# Altium project 4_bit_alu.PrjPcb
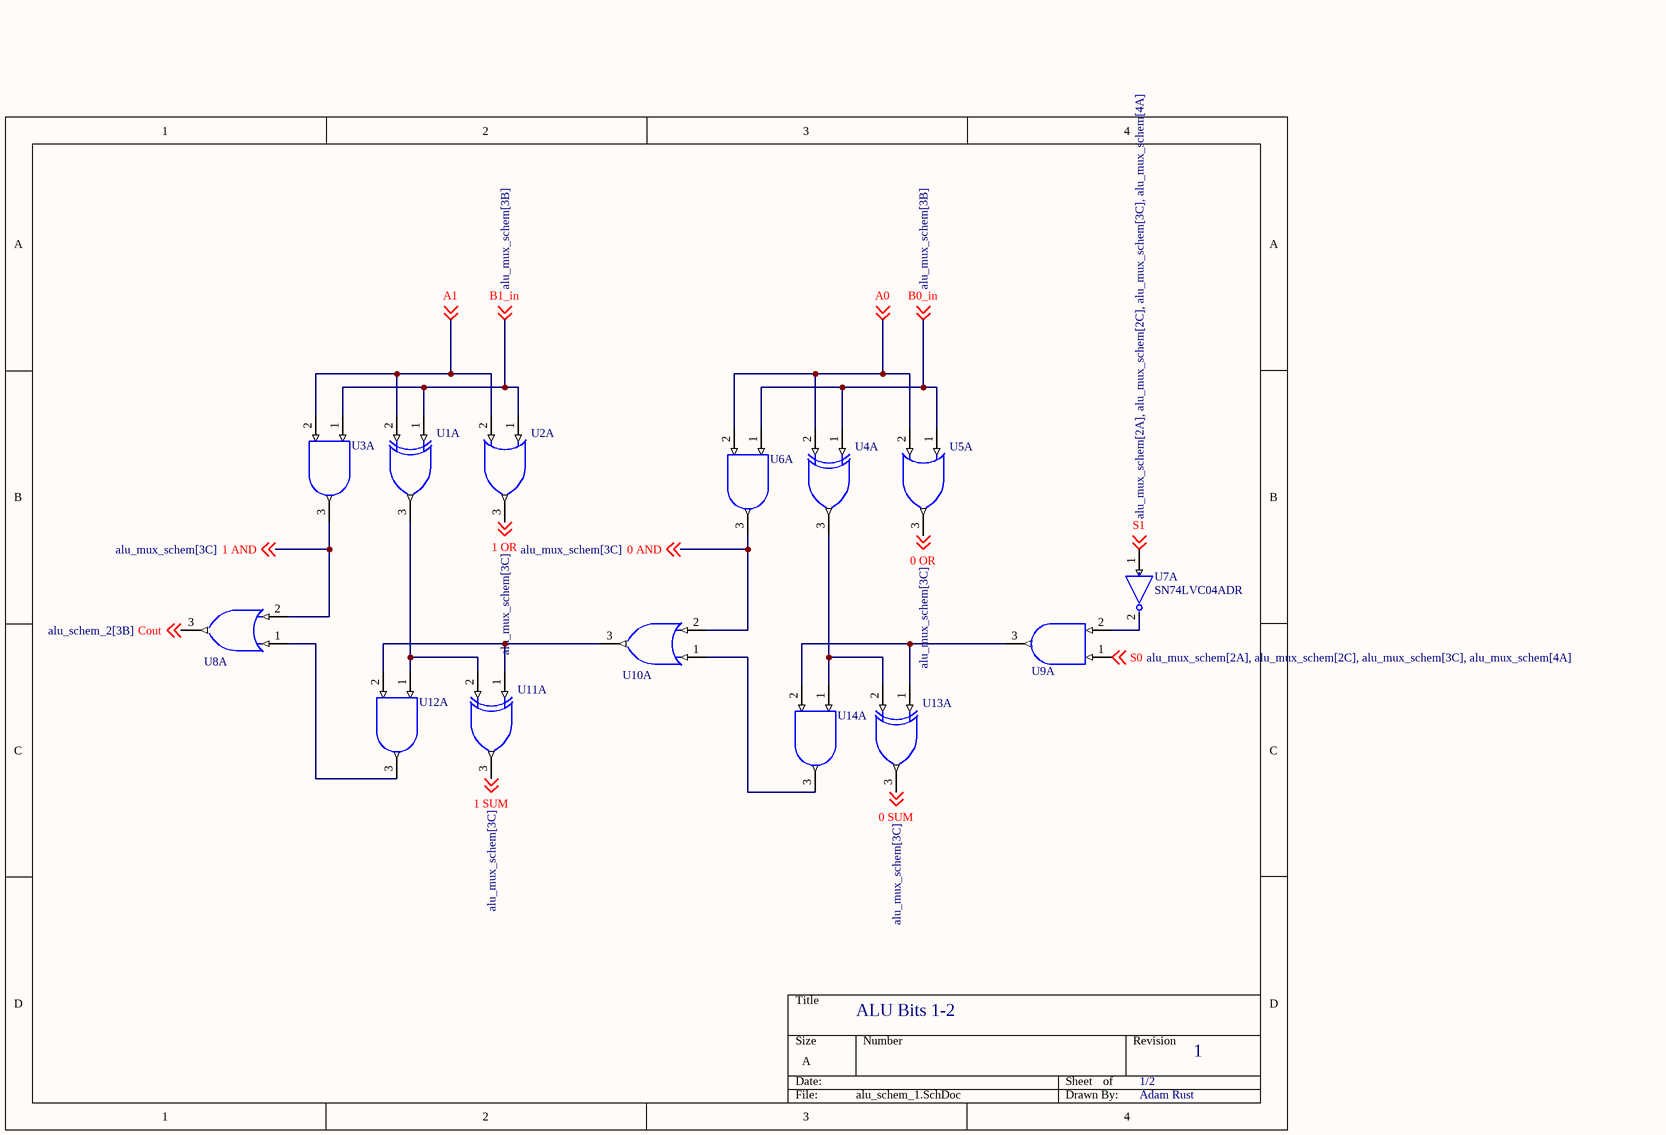
[diagram p0: alu_schem_1.SchDoc]
4 sheets, 39 parts. Net scope: global (net labels, ports and power ports of the same name join across sheets).
Sheets:
  alu_schem_1.SchDoc
  alu_schem_2.SchDoc
  alu_mux_schem.SchDoc
  alu_raspberrypi_micro.SchDoc

## Sheet alu_schem_1.SchDoc
size A; SheetNumber: 1; SheetTotal: 4

### Parts
U1  SN74LVC86ARGYR  [RGY0014A_V]  (value not drawn)  (part A of 5)
U2  SN74LVC32APWRG4  [PW0014A_N]  (value not drawn)  (part A of 5)
U3  SN74LVC08ADR  [D0014A_N]  (value not drawn)  (part A of 5)
U4  SN74LVC86ARGYR  [RGY0014A_V]  (value not drawn)  (part A of 5)
U5  SN74LVC32APWRG4  [PW0014A_N]  (value not drawn)  (part A of 5)
U6  SN74LVC08ADR  [D0014A_N]  (value not drawn)  (part A of 5)
U7  SN74LVC04ADR  [FP-D0014A-IPC_A]  (part A of 7)
U8  SN74LVC32APWRG4  [PW0014A_N]  (value not drawn)  (part A of 5)
U9  SN74LVC08ADR  [D0014A_N]  (value not drawn)  (part A of 5)
U10  SN74LVC32APWRG4  [PW0014A_N]  (value not drawn)  (part A of 5)
U11  SN74LVC86ARGYR  [RGY0014A_V]  (value not drawn)  (part A of 5)
U12  SN74LVC08ADR  [D0014A_N]  (value not drawn)  (part A of 5)
U13  SN74LVC86ARGYR  [RGY0014A_V]  (value not drawn)  (part A of 5)
U14  SN74LVC08ADR  [D0014A_N]  (value not drawn)  (part A of 5)

### Nets
0 AND: U6.3(1Y) U10.2(1B) ; off-sheet 0 AND
0 OR: U5.3(1Y) ; off-sheet 0 OR
0 SUM: U13.3(1Y) ; off-sheet 0 SUM
1 AND: U3.3(1Y) U8.2(1B) ; off-sheet 1 AND
1 OR: U2.3(1Y) ; off-sheet 1 OR
1 SUM: U11.3(1Y) ; off-sheet 1 SUM
A0: U4.2(1B) U5.2(1B) U6.2(1B) ; off-sheet A0
A1: U1.2(1B) U2.2(1B) U3.2(1B) ; off-sheet A1
B0_in: U4.1(1A) U5.1(1A) U6.1(1A) ; off-sheet B0_in
B1_in: U1.1(1A) U2.1(1A) U3.1(1A) ; off-sheet B1_in
Cout: U8.3(1Y) ; off-sheet Cout
S0: U9.1(1A) ; off-sheet S0
S1: U7.1(1A) ; off-sheet S1
NetU1_3: U1.3(1Y) U11.2(1B) U12.1(1A)
NetU4_3: U4.3(1Y) U13.2(1B) U14.1(1A)
NetU7_2: U7.2(1Y) U9.2(1B)
NetU8_1: U8.1(1A) U12.3(1Y)
NetU9_3: U9.3(1Y) U13.1(1A) U14.2(1B)
NetU10_1: U10.1(1A) U14.3(1Y)
NetU10_3: U10.3(1Y) U11.1(1A) U12.2(1B)

### Notes on the sheet
- ALU Bits 1-2
- 1/2
- 1
- Adam Rust

### Library data of the parts
U1 U4 U11 U13 = CMP-0778-00157-4: Quadruple 2-Input Exclusive-OR Gate, RGY0014A, LARGE T&R; Manufacturer: Texas Instruments; Bits(#): 4; Output Type: TTL; Schmitt Trigger: No; VCC(Min)(V): 1.65; tpd @ Nom Voltage(Max)(ns): 9.9,7.6,5.6,4.6; Voltage(Nom)(V): 1.8,2.5,2.7,3.3; VCC(Max)(V): 3.6; Output Drive (IOL/IOH)(Max)(mA): 24/-24; Rating: Catalog; ICC @ Nom Voltage(Max)(mA): 0.01; F @ Nom Voltage(Max)(Mhz): 70; Technology Family: LVC; PackageReference: RGY0014A; DatasheetVersion: SCAS288P; Generic Part Number: SN74LVC86A; Input Type: TTL; Operating Temperature Range(C): -40 to 125
U2 U5 U8 U10 = CMP-1573-00193-3: Quadruple 2-Input Positive-OR Gate, PW0014A, LARGE T&R; Manufacturer: Texas Instruments; ICC @ Nom Voltage(Max)(mA): 0.04; VCC(Max)(V): 3.6; F @ Nom Voltage(Max)(Mhz): 70; VCC(Min)(V): 1.65; Voltage(Nom)(V): 1.8,2.5,2.7,3.3; Input Type: TTL; Bits(#): 4; Output Drive (IOL/IOH)(Max)(mA): 24/-24; tpd @ Nom Voltage(Max)(ns): 8.7,5.4,4.4,3.8; Rating: Catalog; DatasheetVersion: SCAS286Q; Operating Temperature Range(C): -40 to 105,-40 to 125; Generic Part Number: SN74LVC32A; PackageVersion: http://www.ti.com/lit/ml/mpds360/mpds360.pdf; PackageReference: PW0014A; Code_JEDEC: MO-153; Output Type: TTL
U3 U6 U9 U12 U14 = CMP-0777-00108-3: Quadruple 2-Input Positive-AND Gate, D0014A, LARGE T&R; Manufacturer: Texas Instruments; Input Type: TTL; Output Drive (IOL/IOH)(Max)(mA): -24/24; Rating: Catalog; Technology Family: LVC; tpd @ Nom Voltage(Max)(ns): 9.8,6.9,4.8,4.1; ICC @ Nom Voltage(Max)(mA): 0.01; Voltage(Nom)(V): 1.8,2.5,2.7,3.3; F @ Nom Voltage(Max)(Mhz): 70; Schmitt Trigger: No; Bits(#): 4; VCC(Max)(V): 3.6; VCC(Min)(V): 1.65; Generic Part Number: SN74LVC08A; Output Type: TTL; DatasheetVersion: SCAS283Q; Operating Temperature Range(C): -40 to 125; PackageReference: D0014A
U7 = CMP-1615-00157-3: IC INVERTER 6CH 6-INP 14SOIC; High Level Output Current: -24mA; Number of Gates: 6; Max Supply Voltage: 3.6V; Output Current: 24mA; Quiescent Current: 1uA; Min Supply Voltage: 1.65V; Number of Inputs: 1; Logic Function: Buffer; Turn-On Delay Time: 4.5ns; Propagation Delay: 9.5ns; Number of Pins: 14; Weight: 0.004318oz; Number of Bits: 6; Number of Elements: 6; Min Operating Temperature: -40°C; Case/Package: SOIC; Technology: CMOS; Mount: Surface Mount; Package Quantity: 1; Low Level Output Current: 24mA; Radiation Hardening: No; Lead Free: Lead Free; Series: 74LVC; Max Operating Temperature: 125°C; RoHS Compliant: Yes; Packaging: Tape and Reel; REACH SVHC: No SVHC; Contact Plating: Gold; Number of Circuits: 6

## Sheet alu_schem_2.SchDoc
size A; SheetNumber: 2; SheetTotal: 3
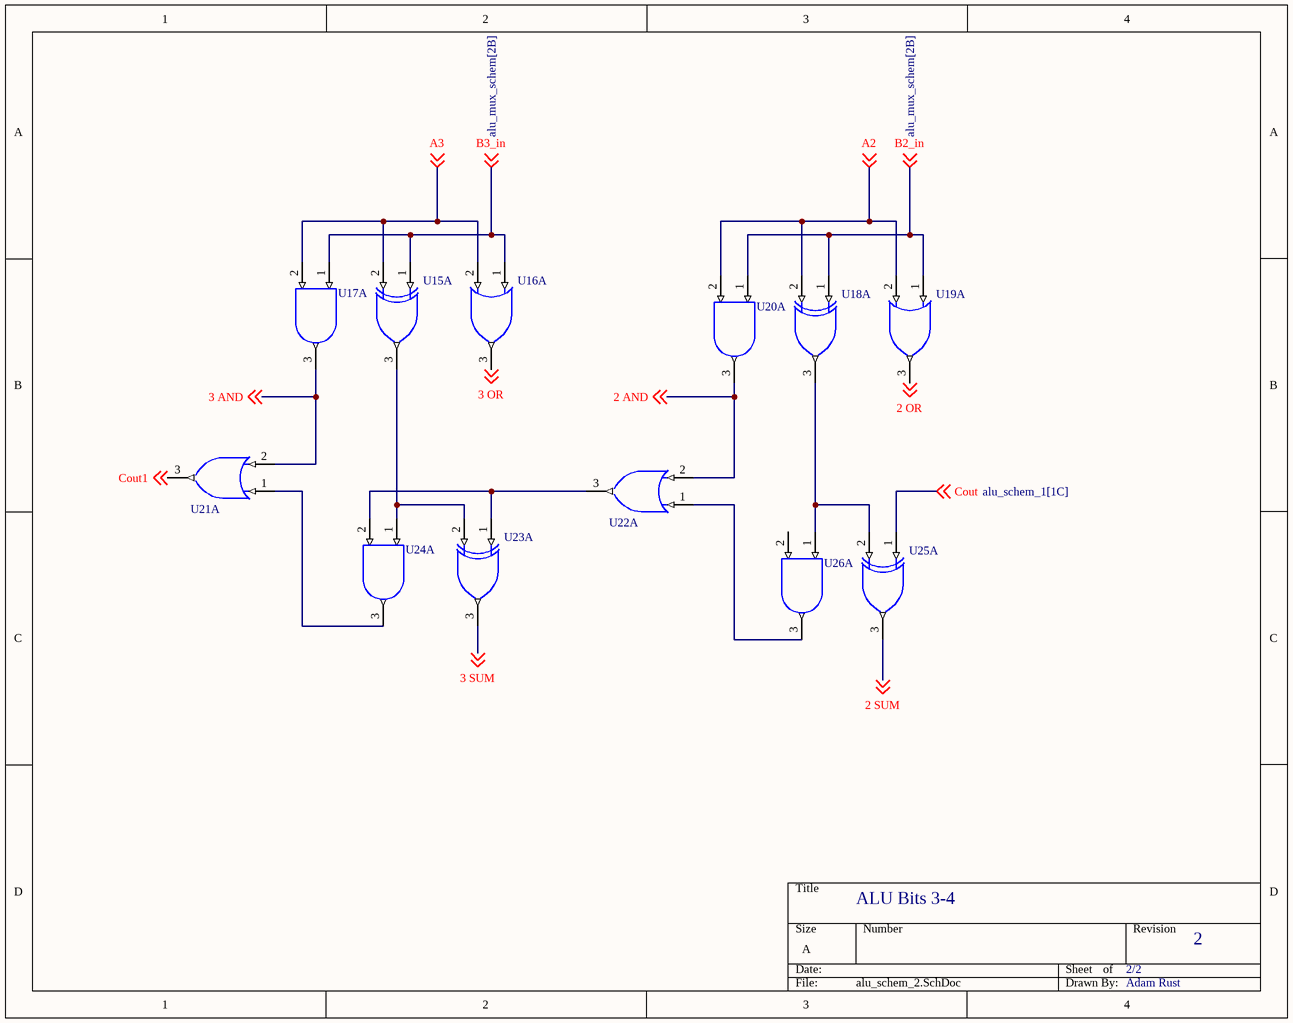
[diagram p1: alu_schem_2.SchDoc]

### Parts
U15  SN74LVC86ARGYR  [RGY0014A_V]  (value not drawn)  (part A of 5)
U16  SN74LVC32APWRG4  [PW0014A_N]  (value not drawn)  (part A of 5)
U17  SN74LVC08ADR  [D0014A_N]  (value not drawn)  (part A of 5)
U18  SN74LVC86ARGYR  [RGY0014A_V]  (value not drawn)  (part A of 5)
U19  SN74LVC32APWRG4  [PW0014A_N]  (value not drawn)  (part A of 5)
U20  SN74LVC08ADR  [D0014A_N]  (value not drawn)  (part A of 5)
U21  SN74LVC32APWRG4  [PW0014A_N]  (value not drawn)  (part A of 5)
U22  SN74LVC32APWRG4  [PW0014A_N]  (value not drawn)  (part A of 5)
U23  SN74LVC86ARGYR  [RGY0014A_V]  (value not drawn)  (part A of 5)
U24  SN74LVC08ADR  [D0014A_N]  (value not drawn)  (part A of 5)
U25  SN74LVC86ARGYR  [RGY0014A_V]  (value not drawn)  (part A of 5)
U26  SN74LVC08ADR  [D0014A_N]  (value not drawn)  (part A of 5)

### Nets
2 AND: U20.3(1Y) U22.2(1B) ; off-sheet 2 AND
2 OR: U19.3(1Y) ; off-sheet 2 OR
2 SUM: U25.3(1Y) ; off-sheet 2 SUM
3 AND: U17.3(1Y) U21.2(1B) ; off-sheet 3 AND
3 OR: U16.3(1Y) ; off-sheet 3 OR
3 SUM: U23.3(1Y) ; off-sheet 3 SUM
A2: U18.2(1B) U19.2(1B) U20.2(1B) ; off-sheet A2
A3: U15.2(1B) U16.2(1B) U17.2(1B) ; off-sheet A3
B2_in: U18.1(1A) U19.1(1A) U20.1(1A) ; off-sheet B2_in
B3_in: U15.1(1A) U16.1(1A) U17.1(1A) ; off-sheet B3_in
Cout: U25.1(1A) ; off-sheet Cout
Cout1: U21.3(1Y) ; off-sheet Cout1
NetU15_3: U15.3(1Y) U23.2(1B) U24.1(1A)
NetU18_3: U18.3(1Y) U25.2(1B) U26.1(1A)
NetU21_1: U21.1(1A) U24.3(1Y)
NetU22_1: U22.1(1A) U26.3(1Y)
NetU22_3: U22.3(1Y) U23.1(1A) U24.2(1B)

Not connected (* = marked no-connect by the designer): U26 2(1B)

### Notes on the sheet
- ALU Bits 3-4
- 2/2
- 2
- Adam Rust

### Library data of the parts
U15 U18 U23 U25 = CMP-0778-00157-4: as U1 on sheet alu_schem_1; PackageReference: RGY0014A; DatasheetVersion: SCAS288P; Generic Part Number: SN74LVC86A; Input Type: TTL; Operating Temperature Range(C): -40 to 125
U16 U19 U21 U22 = CMP-1573-00193-3: as U2 on sheet alu_schem_1; DatasheetVersion: SCAS286Q; Operating Temperature Range(C): -40 to 105,-40 to 125; Generic Part Number: SN74LVC32A; PackageVersion: http://www.ti.com/lit/ml/mpds360/mpds360.pdf; PackageReference: PW0014A; Code_JEDEC: MO-153; Output Type: TTL
U17 U20 U24 U26 = CMP-0777-00108-3: as U3 on sheet alu_schem_1; Generic Part Number: SN74LVC08A; Output Type: TTL; DatasheetVersion: SCAS283Q; Operating Temperature Range(C): -40 to 125; PackageReference: D0014A

## Sheet alu_mux_schem.SchDoc
size A; SheetNumber: 3; SheetTotal: 4
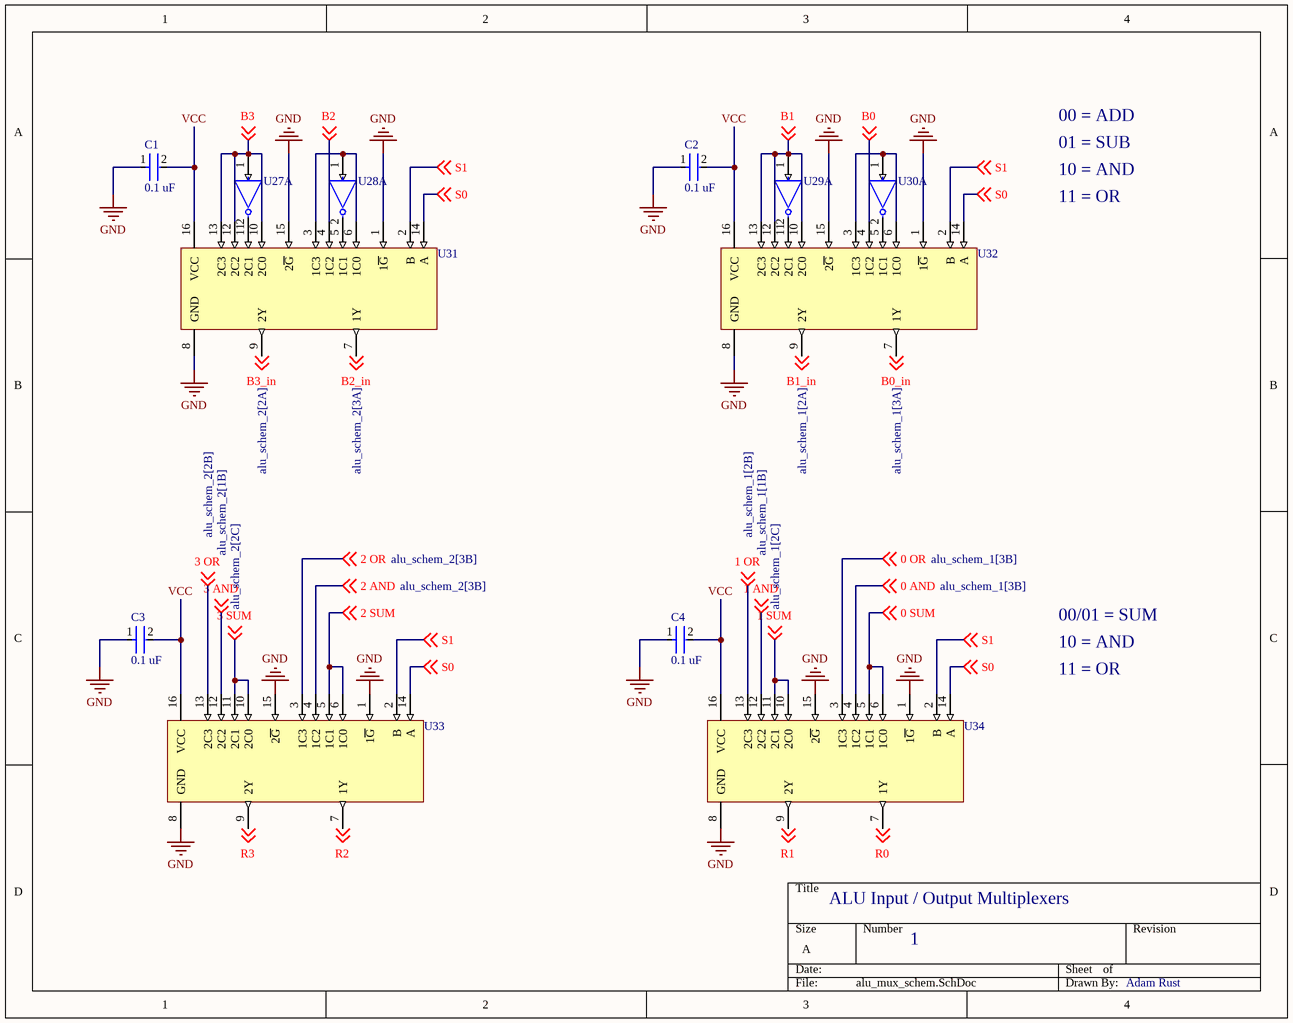
[diagram p2: alu_mux_schem.SchDoc]

### Parts
C1  0.1 uF  [FP-GRM022-0_02-MFG]
C2  0.1 uF  [FP-GRM022-0_02-MFG]
C3  0.1 uF  [FP-GRM022-0_02-MFG]
C4  0.1 uF  [FP-GRM022-0_02-MFG]
U27  SN74LVC04ADR  [FP-D0014A-IPC_A]  (value not drawn)  (part A of 7)
U28  SN74LVC04ADR  [FP-D0014A-IPC_A]  (value not drawn)  (part A of 7)
U29  SN74LVC04ADR  [FP-D0014A-IPC_A]  (value not drawn)  (part A of 7)
U30  SN74LVC04ADR  [FP-D0014A-IPC_A]  (value not drawn)  (part A of 7)
U31  SN74HC153DR  [D0016A_N]  (value not drawn)
U32  SN74HC153DR  [D0016A_N]  (value not drawn)
U33  SN74HC153DR  [D0016A_N]  (value not drawn)
U34  SN74HC153DR  [D0016A_N]  (value not drawn)

### Nets
GND: C1.1 C2.1 C3.1 C4.1 U31.1(1~{G}) U31.8(GND) U31.15(2~{G}) U32.1(1~{G}) U32.8(GND) U32.15(2~{G}) U33.1(1~{G}) U33.8(GND) U33.15(2~{G}) U34.1(1~{G}) U34.8(GND) U34.15(2~{G})
0 AND: U34.4(1C2) ; off-sheet 0 AND
0 OR: U34.3(1C3) ; off-sheet 0 OR
0 SUM: U34.5(1C1) U34.6(1C0) ; off-sheet 0 SUM
1 AND: U34.12(2C2) ; off-sheet 1 AND
1 OR: U34.13(2C3) ; off-sheet 1 OR
1 SUM: U34.10(2C0) U34.11(2C1) ; off-sheet 1 SUM
2 AND: U33.4(1C2) ; off-sheet 2 AND
2 OR: U33.3(1C3) ; off-sheet 2 OR
2 SUM: U33.5(1C1) U33.6(1C0) ; off-sheet 2 SUM
3 AND: U33.12(2C2) ; off-sheet 3 AND
3 OR: U33.13(2C3) ; off-sheet 3 OR
3 SUM: U33.10(2C0) U33.11(2C1) ; off-sheet 3 SUM
B0: U32.4(1C2) ; off-sheet B0
B0_in: U32.7(1Y) ; off-sheet B0_in
B1: U29.1(1A) U32.10(2C0) U32.12(2C2) U32.13(2C3) ; off-sheet B1
B1_in: U32.9(2Y) ; off-sheet B1_in
B2: U31.4(1C2) ; off-sheet B2
B2_in: U31.7(1Y) ; off-sheet B2_in
B3: U27.1(1A) U31.10(2C0) U31.12(2C2) U31.13(2C3) ; off-sheet B3
B3_in: U31.9(2Y) ; off-sheet B3_in
R0: U34.7(1Y) ; off-sheet R0
R1: U34.9(2Y) ; off-sheet R1
R2: U33.7(1Y) ; off-sheet R2
R3: U33.9(2Y) ; off-sheet R3
S0: U31.14(A) U32.14(A) U33.14(A) U34.14(A) ; off-sheet S0
S1: U31.2(B) U32.2(B) U33.2(B) U34.2(B) ; off-sheet S1
VCC: C1.2 C2.2 C3.2 C4.2 U31.16(VCC) U32.16(VCC) U33.16(VCC) U34.16(VCC)
NetU27_2: U27.2(1Y) U31.11(2C1)
NetU28_1: U28.1(1A) U31.3(1C3) U31.6(1C0)
NetU28_2: U28.2(1Y) U31.5(1C1)
NetU29_2: U29.2(1Y) U32.11(2C1)
NetU30_1: U30.1(1A) U32.3(1C3) U32.6(1C0)
NetU30_2: U30.2(1Y) U32.5(1C1)

### Notes on the sheet
- 00 = ADD
- 01 = SUB
- 10 = AND
- 11 = OR
- 00/01 = SUM
- ALU Input / Output Multiplexers
- 1
- Adam Rust

### Library data of the parts
C1-C4 = CMP-00260-135708700-1: GRM022R61C104ME05L Multilayer Ceramic Capacitor, 0.1 uF, 16 V, ± 20%, X5R, 01005 [0402 Metric]; Voltage Rating (DC): 16V; Capacitance: 100nF; Dielectric: X5R; Length: 400µm; Material: Ceramic; Case/Package: 0402; Max Operating Temperature: 85°C; Thickness: 200µm; Voltage Rating: 16V; Min Operating Temperature: -55°C; Lifecycle Status: Production; Tolerance: 20%; Width: 200µm; Height: 400µm; NexarPartId: 135708700
U27-U30 = CMP-1615-00157-3: as U7 on sheet alu_schem_1; Number of Pins: 14; Weight: 0.004318oz; Number of Bits: 6; Number of Elements: 6; Min Operating Temperature: -40°C; Case/Package: SOIC; Technology: CMOS; Mount: Surface Mount; Package Quantity: 1; Low Level Output Current: 24mA; Radiation Hardening: No; Lead Free: Lead Free; Series: 74LVC; Max Operating Temperature: 125°C; RoHS Compliant: Yes; Packaging: Tape and Reel; REACH SVHC: No SVHC; Contact Plating: Gold; Number of Circuits: 6
U31-U34 = CMP-1628-00005-2: Dual 4-Line To 1-Line Data Selectors/Multiplexers, D0016A, LARGE T&R; Manufacturer: Texas Instruments; tpd @ Nom Voltage(Max)(ns): 38; Configuration: 4：1; Channels(#): 2; Bits(#): 4; Function: Encoder/Multiplexer; Input Type: LVTTL/CMOS; VCC(Max)(V): 6; ICC @ Nom Voltage(Max)(mA): 8; Output Type: CMOS; Output Drive (IOL/IOH)(Max)(mA): 7.8/-7.8; Technology Family: HC; F @ Nom Voltage(Max)(Mhz): 28; Schmitt Trigger: No; Rating: Catalog; Voltage(Nom)(V): 3.3,5; Code_JEDEC: MS-012 variation AC; Operating Temperature Range(C): -40 to 85; DatasheetVersion: SCLS112D; Type: Standard; VCC(Min)(V): 2; Generic Part Number: SN74HC153; PackageReference: D0016A

## Sheet alu_raspberrypi_micro.SchDoc
size A; SheetNumber: 4; SheetTotal: 4
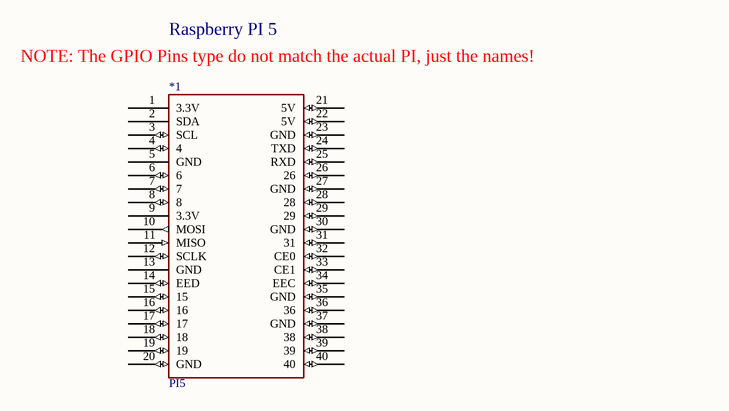
[diagram p3: alu_raspberrypi_micro.SchDoc]

### Parts
*1  PI5

### Nets

Not connected (* = marked no-connect by the designer): *1 1(3.3V) 2(SDA) 3(SCL) 4 5(GND) 6 7 8 9(3.3V) 10(MOSI) 11(MISO) 12(SCLK) 13(GND) 14(EED) 15 16 17 18 19 20(GND) 21(5V) 22(5V) 23(GND) 24(TXD) 25(RXD) 26 27(GND) 28 29 30(GND) 31 32(CE0) 33(CE1) 34(EEC) 35(GND) 36 37(GND) 38 39 40

### Notes on the sheet
- Raspberry PI 5
- (near *1) NOTE: The GPIO Pins type do not match the actual PI, just the names!

## Nets that join several sheets
0 AND: alu_schem_1 (U6.3 U10.2), alu_mux_schem (U34.4)
0 OR: alu_schem_1 (U5.3), alu_mux_schem (U34.3)
0 SUM: alu_schem_1 (U13.3), alu_mux_schem (U34.5 U34.6)
1 AND: alu_schem_1 (U3.3 U8.2), alu_mux_schem (U34.12)
1 OR: alu_schem_1 (U2.3), alu_mux_schem (U34.13)
1 SUM: alu_schem_1 (U11.3), alu_mux_schem (U34.10 U34.11)
2 AND: alu_schem_2 (U20.3 U22.2), alu_mux_schem (U33.4)
2 OR: alu_schem_2 (U19.3), alu_mux_schem (U33.3)
2 SUM: alu_schem_2 (U25.3), alu_mux_schem (U33.5 U33.6)
3 AND: alu_schem_2 (U17.3 U21.2), alu_mux_schem (U33.12)
3 OR: alu_schem_2 (U16.3), alu_mux_schem (U33.13)
3 SUM: alu_schem_2 (U23.3), alu_mux_schem (U33.10 U33.11)
B0_in: alu_schem_1 (U4.1 U5.1 U6.1), alu_mux_schem (U32.7)
B1_in: alu_schem_1 (U1.1 U2.1 U3.1), alu_mux_schem (U32.9)
B2_in: alu_schem_2 (U18.1 U19.1 U20.1), alu_mux_schem (U31.7)
B3_in: alu_schem_2 (U15.1 U16.1 U17.1), alu_mux_schem (U31.9)
Cout: alu_schem_1 (U8.3), alu_schem_2 (U25.1)
S0: alu_schem_1 (U9.1), alu_mux_schem (U31.14 U32.14 U33.14 U34.14)
S1: alu_schem_1 (U7.1), alu_mux_schem (U31.2 U32.2 U33.2 U34.2)